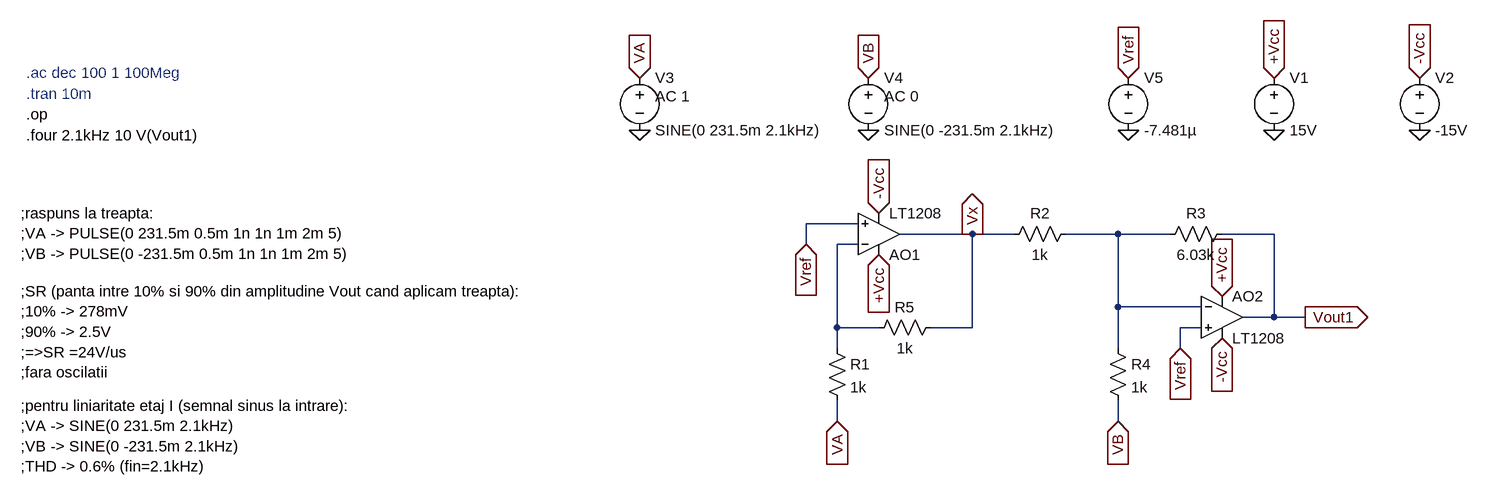
[diagram p0: schematic AI.asc]
AI.asc, the LTspice schematic file:
Version 4.1
SHEET 1 880 680
WIRE -128 -48 -208 -48
WIRE 48 -32 -64 -32
WIRE 112 -32 48 -32
WIRE 272 -32 192 -32
WIRE 352 -32 272 -32
WIRE 512 -32 432 -32
WIRE -208 -16 -208 -48
WIRE -128 -16 -160 -16
WIRE 272 80 272 -32
WIRE 400 80 272 80
WIRE 512 96 512 -32
WIRE 512 96 464 96
WIRE 560 96 512 96
WIRE -160 112 -160 -16
WIRE -96 112 -160 112
WIRE 48 112 48 -32
WIRE 48 112 -16 112
WIRE 400 112 368 112
WIRE -160 144 -160 112
WIRE 272 144 272 80
WIRE 368 144 368 112
WIRE -160 256 -160 224
WIRE 272 256 272 224
FLAG 272 256 VB
IOPIN 272 256 In
FLAG -160 256 VA
IOPIN -160 256 In
FLAG 560 96 Vout1
IOPIN 560 96 Out
FLAG -96 0 +Vcc
IOPIN -96 0 In
FLAG 432 64 +Vcc
IOPIN 432 64 In
FLAG -96 -64 -Vcc
IOPIN -96 -64 In
FLAG 432 128 -Vcc
IOPIN 432 128 In
FLAG 48 -32 Vx
IOPIN 48 -32 Out
FLAG -464 -192 0
FLAG -112 -192 0
FLAG -464 -272 VA
IOPIN -464 -272 In
FLAG -112 -272 VB
IOPIN -112 -272 In
FLAG 512 -272 +Vcc
IOPIN 512 -272 In
FLAG 736 -272 -Vcc
IOPIN 736 -272 In
FLAG 512 -192 0
FLAG 736 -192 0
FLAG 288 -192 0
FLAG 288 -272 Vref
IOPIN 288 -272 In
FLAG 368 144 Vref
IOPIN 368 144 In
FLAG -208 -16 Vref
IOPIN -208 -16 In
DATAFLAG 528 96 ""
SYMBOL OpAmps\\LT1208 -96 32 M180
SYMATTR InstName AO1
SYMBOL res -176 128 R0
SYMATTR InstName R1
SYMATTR Value 1k
SYMBOL res 96 -16 R270
WINDOW 0 32 56 VTop 2
WINDOW 3 0 56 VBottom 2
SYMATTR InstName R2
SYMATTR Value 1k
SYMBOL res 336 -16 R270
WINDOW 0 32 56 VTop 2
WINDOW 3 0 56 VBottom 2
SYMATTR InstName R3
SYMATTR Value 6.03k
SYMBOL res 256 128 R0
SYMATTR InstName R4
SYMATTR Value 1k
SYMBOL OpAmps\\LT1208 432 32 R0
SYMATTR InstName AO2
SYMBOL res -112 128 R270
WINDOW 0 32 56 VTop 2
WINDOW 3 0 56 VBottom 2
SYMATTR InstName R5
SYMATTR Value 1k
SYMBOL voltage 512 -288 R0
WINDOW 123 24 44 Left 2
WINDOW 39 0 0 Left 0
SYMATTR InstName V1
SYMATTR Value 15V
SYMBOL voltage 736 -288 R0
SYMATTR InstName V2
SYMATTR Value -15V
SYMBOL voltage -464 -288 R0
WINDOW 123 24 44 Left 2
WINDOW 39 0 0 Left 0
SYMATTR Value2 AC 1
SYMATTR InstName V3
SYMATTR Value SINE(0 231.5m 2.1kHz)
SYMBOL voltage -112 -288 R0
WINDOW 123 24 44 Left 2
WINDOW 39 0 0 Left 0
SYMATTR Value2 AC 0
SYMATTR InstName V4
SYMATTR Value SINE(0 -231.5m 2.1kHz)
SYMBOL voltage 288 -288 R0
WINDOW 123 0 0 Left 0
WINDOW 39 0 0 Left 0
SYMATTR InstName V5
SYMATTR Value -7.481µ
TEXT -1408 -280 Left 2 ;.ac dec 100 1 100Meg
TEXT -1408 -248 Left 2 ;.tran 10m
TEXT -1408 -216 Left 2 !.op
TEXT -1408 -184 Left 2 !.four 2.1kHz 10 V(Vout1)
TEXT -1416 -64 Left 2 !;raspuns la treapta: \n;VA -> PULSE(0 231.5m 0.5m 1n 1n 1m 2m 5)\n;VB -> PULSE(0 -231.5m 0.5m 1n 1n 1m 2m 5)
TEXT -1416 56 Left 2 !;SR (panta intre 10% si 90% din amplitudine Vout cand aplicam treapta):\n;10% -> 278mV\n;90% -> 2.5V\n;=>SR =24V/us\n;fara oscilatii
TEXT -1416 232 Left 2 !;pentru liniaritate etaj I (semnal sinus la intrare):\n;VA -> SINE(0 231.5m 2.1kHz)\n;VB -> SINE(0 -231.5m 2.1kHz)\n;THD -> 0.6% (fin=2.1kHz)

The netlist it stands for:
* AI.asc
X§AO1 Vref N002 +Vcc -Vcc Vx LT1208  ; pins In+ In- V+ V- OUT
R1 N002 VA 1k
R2 Vx N001 1k
R3 N001 Vout1 6.03k
R4 N001 VB 1k
X§AO2 Vref N001 +Vcc -Vcc Vout1 LT1208  ; pins In+ In- V+ V- OUT
R5 N002 Vx 1k
V1 +Vcc 0 15V
V2 -Vcc 0 -15V
V3 VA 0 SINE(0 231.5m 2.1kHz) AC 1
V4 VB 0 SINE(0 -231.5m 2.1kHz) AC 0
V5 Vref 0 -7.481µ
* .ac dec 100 1 100Meg
* .tran 10m
.op
.four 2.1kHz 10 V(Vout1)
;raspuns la treapta:
;VA -> PULSE(0 231.5m 0.5m 1n 1n 1m 2m 5)
;VB -> PULSE(0 -231.5m 0.5m 1n 1n 1m 2m 5)
;SR (panta intre 10% si 90% din amplitudine Vout cand aplicam treapta):
;10% -> 278mV
;90% -> 2.5V
;=>SR =24V/us
;fara oscilatii
;pentru liniaritate etaj I (semnal sinus la intrare):
;VA -> SINE(0 231.5m 2.1kHz)
;VB -> SINE(0 -231.5m 2.1kHz)
;THD -> 0.6% (fin=2.1kHz)
.backanno
.end